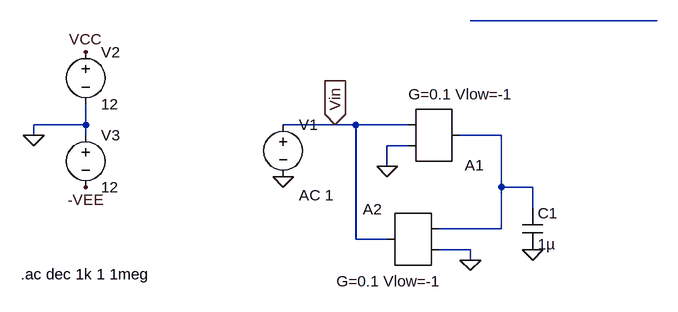
[diagram p0: schematic EJE5_B.asc]
EJE5_B.asc, the LTspice schematic file:
Version 4
SHEET 1 880 680
WIRE 384 16 96 16
WIRE -496 176 -496 144
WIRE -496 176 -576 176
WIRE -112 176 -192 176
WIRE -80 176 -112 176
WIRE 0 176 -80 176
WIRE -576 192 -576 176
WIRE -496 192 -496 176
WIRE 144 192 80 192
WIRE 0 208 -32 208
WIRE -32 240 -32 208
WIRE 144 272 144 192
WIRE 192 272 144 272
WIRE 192 304 192 272
WIRE 144 336 144 272
WIRE 144 336 48 336
WIRE -80 352 -80 176
WIRE -32 352 -80 352
WIRE 96 368 48 368
WIRE 96 384 96 368
FLAG -192 256 0
FLAG -576 192 0
FLAG -496 64 VCC
FLAG -496 272 -VEE
FLAG -112 176 Vin
IOPIN -112 176 In
FLAG -32 240 0
FLAG 96 384 0
FLAG 192 368 0
SYMBOL voltage -192 160 R0
WINDOW 123 24 124 Left 2
SYMATTR InstName V1
SYMATTR Value ""
SYMATTR Value2 AC 1
SYMBOL voltage -496 48 R0
WINDOW 123 0 0 Left 0
WINDOW 39 0 0 Left 0
SYMATTR InstName V2
SYMATTR Value 12
SYMBOL voltage -496 176 R0
WINDOW 123 0 0 Left 0
WINDOW 39 0 0 Left 0
SYMATTR InstName V3
SYMATTR Value 12
SYMBOL SpecialFunctions\\ota 32 256 M180
WINDOW 3 -31 127 Left 2
SYMATTR InstName A1
SYMATTR Value G=0.1 Vlow=-1
SYMBOL SpecialFunctions\\ota 16 288 M0
WINDOW 3 -35 129 Left 2
SYMATTR InstName A2
SYMATTR Value G=0.1 Vlow=-1
SYMBOL cap 176 304 R0
SYMATTR InstName C1
SYMATTR Value 1µ
TEXT -596 406 Left 2 !.ac dec 1k 1 1meg

The netlist it stands for:
* EJE5_B.asc
V1 Vin 0 AC 1
V2 VCC 0 12
V3 0 -VEE 12
A1 0 Vin 0 0 0 0 N002 0 OTA G=0.1 Vlow=-1
A2 N002 0 0 0 0 0 Vin 0 OTA G=0.1 Vlow=-1
C1 N002 0 1µ
.ac dec 1k 1 1meg
.backanno
.end